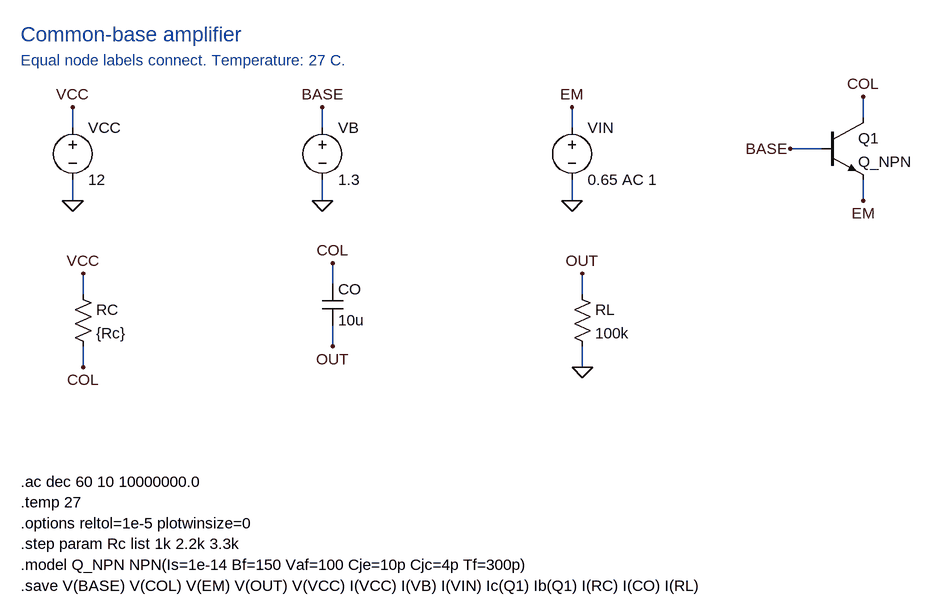
[diagram p0: schematic common-base-amplifier.asc]
common-base-amplifier.asc, the LTspice schematic file:
Version 4
SHEET 1 1740 1032
WIRE 144 176 144 144
WIRE 144 256 144 288
WIRE 528 176 528 144
WIRE 528 256 528 288
WIRE 912 176 912 144
WIRE 912 256 912 288
WIRE 1360 160 1360 128
WIRE 1296 208 1248 208
WIRE 1360 256 1360 288
WIRE 160 432 160 400
WIRE 160 512 160 544
WIRE 544 416 544 384
WIRE 544 480 544 512
WIRE 928 432 928 400
WIRE 928 512 928 544
FLAG 144 144 VCC
FLAG 144 288 0
FLAG 528 144 BASE
FLAG 528 288 0
FLAG 912 144 EM
FLAG 912 288 0
FLAG 1360 128 COL
FLAG 1248 208 BASE
FLAG 1360 288 EM
FLAG 160 400 VCC
FLAG 160 544 COL
FLAG 544 384 COL
FLAG 544 512 OUT
FLAG 928 400 OUT
FLAG 928 544 0
SYMBOL voltage 144 160 R0
SYMATTR InstName VCC
SYMATTR Value 12
SYMBOL voltage 528 160 R0
SYMATTR InstName VB
SYMATTR Value 1.3
SYMBOL voltage 912 160 R0
SYMATTR InstName VIN
SYMATTR Value 0.65 AC 1
SYMBOL npn 1296 160 R0
SYMATTR InstName Q1
SYMATTR Value Q_NPN
SYMBOL res 144 416 R0
SYMATTR InstName RC
SYMATTR Value {Rc}
SYMBOL cap 528 416 R0
SYMATTR InstName CO
SYMATTR Value 10u
SYMBOL res 912 416 R0
SYMATTR InstName RL
SYMATTR Value 100k
TEXT 64 32 Left 3 ;Common-base amplifier
TEXT 64 72 Left 2 ;Equal node labels connect. Temperature: 27 C.
TEXT 64 720 Left 2 !.ac dec 60 10 10000000.0
TEXT 64 752 Left 2 !.temp 27
TEXT 64 784 Left 2 !.options reltol=1e-5 plotwinsize=0
TEXT 64 816 Left 2 !.step param Rc list 1k 2.2k 3.3k
TEXT 64 848 Left 2 !.model Q_NPN NPN(Is=1e-14 Bf=150 Vaf=100 Cje=10p Cjc=4p Tf=300p)
TEXT 64 880 Left 2 !.save V(BASE) V(COL) V(EM) V(OUT) V(VCC) I(VCC) I(VB) I(VIN) Ic(Q1) Ib(Q1) I(RC) I(CO) I(RL)

The netlist it stands for:
* common-base-amplifier.asc
VCC VCC 0 12
VB BASE 0 1.3
VIN EM 0 0.65 AC 1
Q1 COL BASE EM 0 Q_NPN
RC VCC COL {Rc}
CO COL OUT 10u
RL OUT 0 100k
.model NPN NPN
.model PNP PNP
.lib standard.bjt
* Common-base amplifier
* Equal node labels connect. Temperature: 27 C.
.ac dec 60 10 10000000.0
.temp 27
.options reltol=1e-5 plotwinsize=0
.step param Rc list 1k 2.2k 3.3k
.model Q_NPN NPN(Is=1e-14 Bf=150 Vaf=100 Cje=10p Cjc=4p Tf=300p)
.save V(BASE) V(COL) V(EM) V(OUT) V(VCC) I(VCC) I(VB) I(VIN) Ic(Q1) Ib(Q1) I(RC) I(CO) I(RL)
.backanno
.end